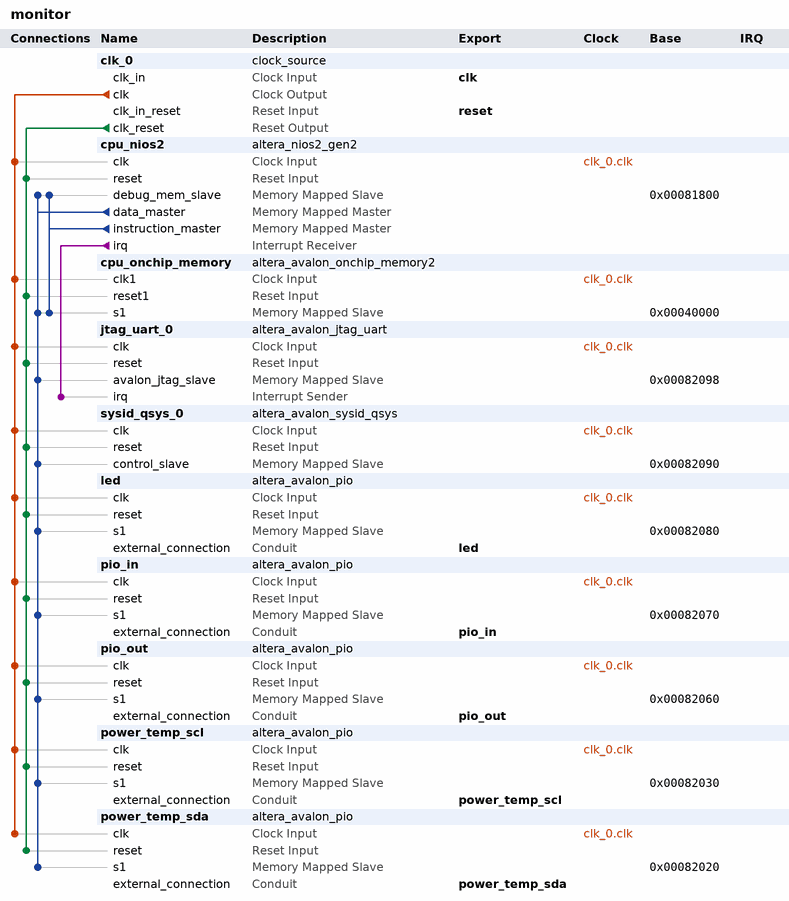
[diagram p0: system contents]
# Platform Designer (Qsys) system monitor, Arria 10 10AX066K3F40E2SG
# Parameters at their usual value, and those the tool derives, are not listed.
package require -exact qsys 1.0
create_system monitor
set_project_property DEVICE_FAMILY {Arria 10}
set_project_property DEVICE 10AX066K3F40E2SG

add_component clk_0 ip/monitor/monitor_clk_0.ip clock_source clk_0 
load_component clk_0
set_component_parameter_value clockFrequency 125000000
save_component

add_component cpu_nios2 ip/monitor/monitor_cpu_nios2.ip altera_nios2_gen2 cpu_nios2 18.1
load_component cpu_nios2
set_component_parameter_value resetSlave cpu_onchip_memory.s1
set_component_parameter_value exceptionSlave cpu_onchip_memory.s1
set_component_parameter_value impl Fast
set_component_parameter_value icache_size 0
set_component_parameter_value dcache_size 0
save_component

add_component cpu_onchip_memory ip/monitor/monitor_cpu_onchip_memory.ip altera_avalon_onchip_memory2 cpu_onchip_memory 18.1
load_component cpu_onchip_memory
set_component_parameter_value dataWidth 32
set_component_parameter_value dualPort false
set_component_parameter_value initMemContent true
set_component_parameter_value initializationFileName onchip_mem.hex
set_component_parameter_value memorySize 65536
save_component

add_component jtag_uart_0 ip/monitor/monitor_jtag_uart_0.ip altera_avalon_jtag_uart jtag_uart_0 18.1
load_component jtag_uart_0
set_component_parameter_value simInteractiveOptions NO_INTERACTIVE_WINDOWS
save_component

add_component sysid_qsys_0 ip/monitor/monitor_sysid_qsys_0.ip altera_avalon_sysid_qsys sysid_qsys_0 18.1
load_component sysid_qsys_0
set_component_parameter_value id 0
set_component_parameter_value ID_VALUE 0
set_component_parameter_value TIMESTAMP 0
save_component

add_component led ip/monitor/monitor_led.ip altera_avalon_pio led 18.1
load_component led
set_component_parameter_value direction Output
set_component_parameter_value width 2
save_component

add_component pio_in ip/monitor/monitor_pio_in.ip altera_avalon_pio pio_in 18.1
load_component pio_in
set_component_parameter_value direction Input
set_component_parameter_value width 32
save_component

add_component pio_out ip/monitor/monitor_pio_out.ip altera_avalon_pio pio_out 18.1
load_component pio_out
set_component_parameter_value direction Output
set_component_parameter_value width 32
save_component

add_component power_temp_scl ip/monitor/monitor_power_temp_scl.ip altera_avalon_pio power_temp_scl 18.1
load_component power_temp_scl
set_component_parameter_value direction Output
set_component_parameter_value resetValue 1
set_component_parameter_value width 1
save_component

add_component power_temp_sda ip/monitor/monitor_power_temp_sda.ip altera_avalon_pio power_temp_sda 18.1
load_component power_temp_sda
set_component_parameter_value direction Bidir
set_component_parameter_value width 1
save_component

# connections
add_connection clk_0.clk cpu_nios2.clk clock
add_connection clk_0.clk cpu_onchip_memory.clk1 clock
add_connection clk_0.clk jtag_uart_0.clk clock
add_connection clk_0.clk led.clk clock
add_connection clk_0.clk pio_in.clk clock
add_connection clk_0.clk pio_out.clk clock
add_connection clk_0.clk power_temp_scl.clk clock
add_connection clk_0.clk power_temp_sda.clk clock
add_connection clk_0.clk sysid_qsys_0.clk clock
add_connection clk_0.clk_reset cpu_nios2.reset reset
add_connection clk_0.clk_reset cpu_onchip_memory.reset1 reset
add_connection clk_0.clk_reset jtag_uart_0.reset reset
add_connection clk_0.clk_reset led.reset reset
add_connection clk_0.clk_reset pio_in.reset reset
add_connection clk_0.clk_reset pio_out.reset reset
add_connection clk_0.clk_reset power_temp_scl.reset reset
add_connection clk_0.clk_reset power_temp_sda.reset reset
add_connection clk_0.clk_reset sysid_qsys_0.reset reset
add_connection cpu_nios2.data_master cpu_nios2.debug_mem_slave avalon
set_connection_parameter_value cpu_nios2.data_master/cpu_nios2.debug_mem_slave baseAddress 0x00081800
add_connection cpu_nios2.data_master cpu_onchip_memory.s1 avalon
set_connection_parameter_value cpu_nios2.data_master/cpu_onchip_memory.s1 baseAddress 0x00040000
add_connection cpu_nios2.data_master jtag_uart_0.avalon_jtag_slave avalon
set_connection_parameter_value cpu_nios2.data_master/jtag_uart_0.avalon_jtag_slave baseAddress 0x00082098
add_connection cpu_nios2.data_master led.s1 avalon
set_connection_parameter_value cpu_nios2.data_master/led.s1 baseAddress 0x00082080
add_connection cpu_nios2.data_master pio_in.s1 avalon
set_connection_parameter_value cpu_nios2.data_master/pio_in.s1 baseAddress 0x00082070
add_connection cpu_nios2.data_master pio_out.s1 avalon
set_connection_parameter_value cpu_nios2.data_master/pio_out.s1 baseAddress 0x00082060
add_connection cpu_nios2.data_master power_temp_scl.s1 avalon
set_connection_parameter_value cpu_nios2.data_master/power_temp_scl.s1 baseAddress 0x00082030
add_connection cpu_nios2.data_master power_temp_sda.s1 avalon
set_connection_parameter_value cpu_nios2.data_master/power_temp_sda.s1 baseAddress 0x00082020
add_connection cpu_nios2.data_master sysid_qsys_0.control_slave avalon
set_connection_parameter_value cpu_nios2.data_master/sysid_qsys_0.control_slave baseAddress 0x00082090
add_connection cpu_nios2.instruction_master cpu_nios2.debug_mem_slave avalon
set_connection_parameter_value cpu_nios2.instruction_master/cpu_nios2.debug_mem_slave baseAddress 0x00081800
add_connection cpu_nios2.instruction_master cpu_onchip_memory.s1 avalon
set_connection_parameter_value cpu_nios2.instruction_master/cpu_onchip_memory.s1 baseAddress 0x00040000
add_connection cpu_nios2.irq jtag_uart_0.irq interrupt

# exported interfaces
add_interface clk clock sink
set_interface_property clk EXPORT_OF clk_0.clk_in
add_interface led conduit end
set_interface_property led EXPORT_OF led.external_connection
add_interface pio_in conduit end
set_interface_property pio_in EXPORT_OF pio_in.external_connection
add_interface pio_out conduit end
set_interface_property pio_out EXPORT_OF pio_out.external_connection
add_interface power_temp_scl conduit end
set_interface_property power_temp_scl EXPORT_OF power_temp_scl.external_connection
add_interface power_temp_sda conduit end
set_interface_property power_temp_sda EXPORT_OF power_temp_sda.external_connection
add_interface reset reset sink
set_interface_property reset EXPORT_OF clk_0.clk_in_reset

set_interconnect_requirement {$system} qsys_mm.clockCrossingAdapter FIFO
set_interconnect_requirement {$system} qsys_mm.maxAdditionalLatency 0
set_interconnect_requirement new_target new_requirement_name new_requirement_value
set_interconnect_requirement new_target new_requirement_name_0 new_requirement_value

save_system monitor.qsys
